# EAGLE design Flodar_Board_V1-3-1 (EAGLE 9.6.2)
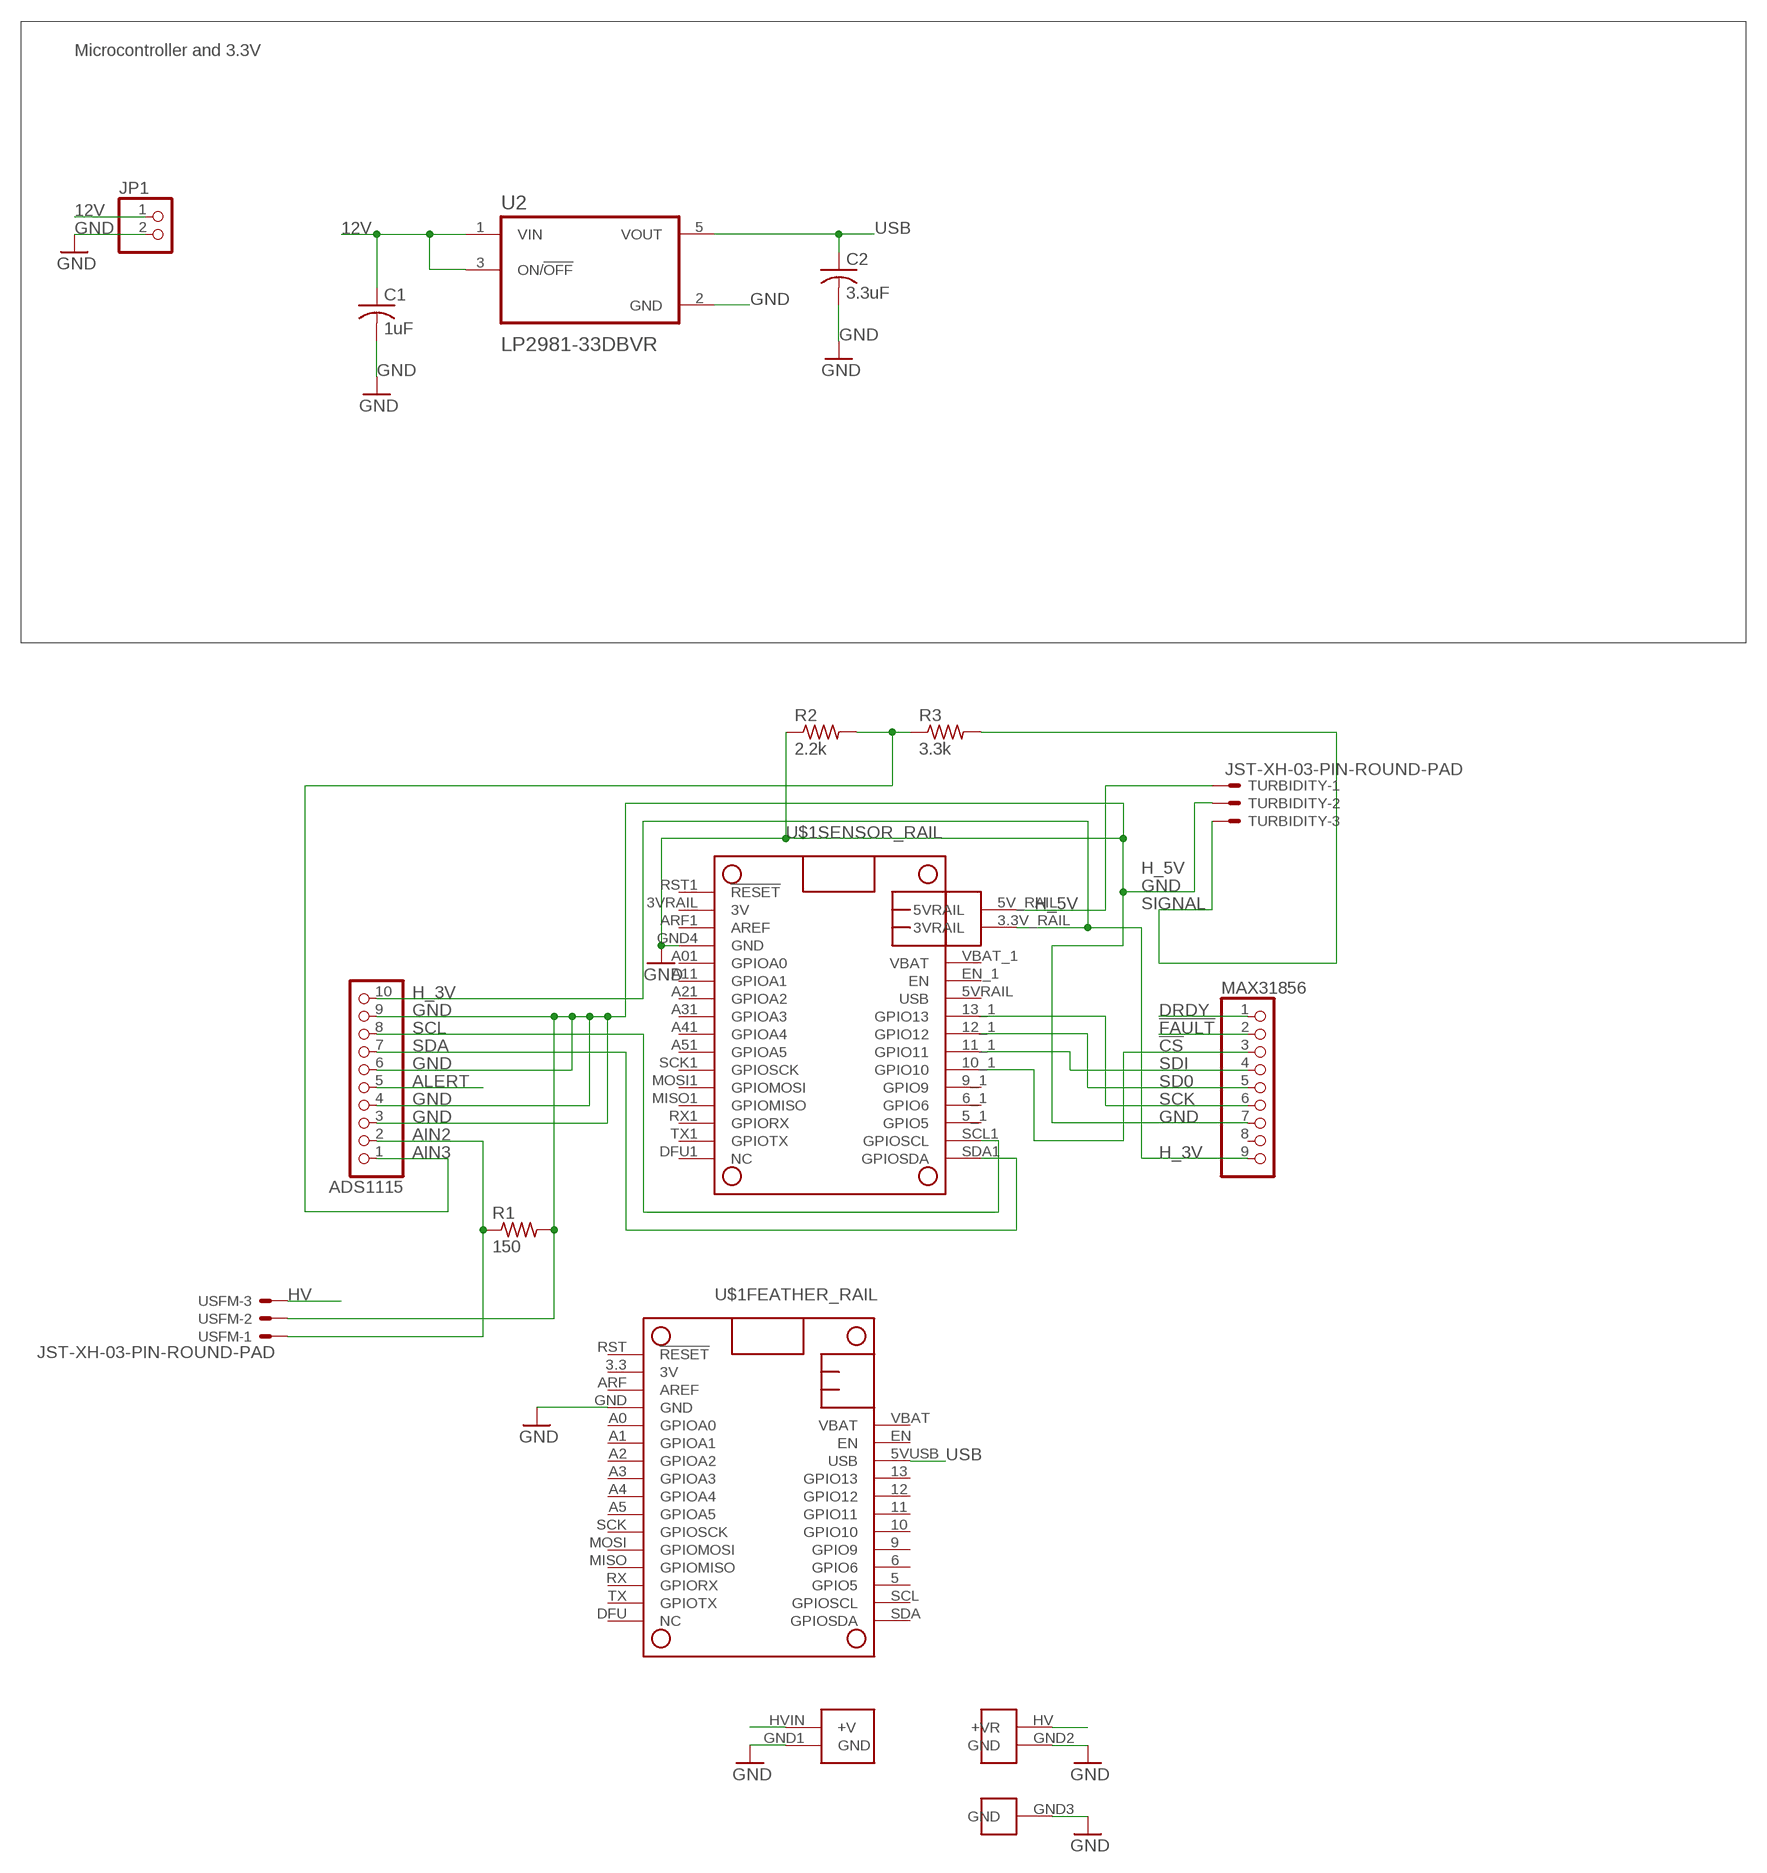
[diagram p0: schematic, sheet 1]

## Parts
ADS1115  HEADER-1X1070MIL  [1X10_ROUND70]
C1  1uF  C-USC1206  [C1206]
C2  3.3uF  C-USC1206  [C1206]
JP1  PINHD-1X2  [1X02]
MAX31856  HEADER-1X970MIL  [1X09_ROUND_70]
R1  150  R-US_R1206  [R1206]
R2  2.2k  R-US_R1206  [R1206]
R3  3.3k  R-US_R1206  [R1206]
TURBIDITY  JST-XH-03-PIN-ROUND-PAD  [JST-XH-03-PACKAGE-ROUND-PAD]
U2  LP2981-33DBVR  LP2981-50DBVR  [SOT95P280X145-5N]
U$1  HYPNOS_V3  [HYPNOS_V3]
USFM  JST-XH-03-PIN-ROUND-PAD  [JST-XH-03-PACKAGE-ROUND-PAD]

## Nets
12V: C1.1 JP1.1 U2.1(VIN) U2.3(ON/!OFF) U$1.HVIN(+V)
!CS: MAX31856.3 U$1.10_1(SENSOR_RAIL:GPIO10)
!FAULT: MAX31856.2
AIN2: ADS1115.2 R1.1 USFM.1
AIN3: ADS1115.1 R2.2 R3.1
ALERT: ADS1115.5
DRDY: MAX31856.1
GND: ADS1115.3 ADS1115.4 ADS1115.6 ADS1115.9 C1.2 C2.2 JP1.2 MAX31856.7 R1.2 R2.1 TURBIDITY.2 U2.2(GND) U$1.GND1(GND) U$1.GND2(GND) U$1.GND3(GND) U$1.GND4(SENSOR_RAIL:GND) U$1.GND(FEATHER_RAIL:GND) USFM.2
H_3V: ADS1115.10 MAX31856.9 U$1.3.3V_RAIL(3VRAIL)
H_5V: TURBIDITY.1 U$1.5V_RAIL(5VRAIL)
HV: U$1.HV(+VR) USFM.3
SCK: MAX31856.6 U$1.13_1(SENSOR_RAIL:GPIO13)
SCL: ADS1115.8 U$1.SCL1(SENSOR_RAIL:GPIOSCL)
SD0: MAX31856.5 U$1.12_1(SENSOR_RAIL:GPIO12)
SDA: ADS1115.7 U$1.SDA1(SENSOR_RAIL:GPIOSDA)
SDI: MAX31856.4 U$1.11_1(SENSOR_RAIL:GPIO11)
SIGNAL: R3.2 TURBIDITY.3
USB: C2.1 U2.5(VOUT) U$1.5VUSB(FEATHER_RAIL:USB)
Unconnected: MAX31856.8 U$1.3.3(FEATHER_RAIL:3V) U$1.3VRAIL(SENSOR_RAIL:3V) U$1.5(FEATHER_RAIL:GPIO5) U$1.5_1(SENSOR_RAIL:GPIO5) U$1.5VRAIL(SENSOR_RAIL:USB) U$1.6(FEATHER_RAIL:GPIO6) U$1.6_1(SENSOR_RAIL:GPIO6) U$1.9(FEATHER_RAIL:GPIO9) U$1.9_1(SENSOR_RAIL:GPIO9) U$1.10(FEATHER_RAIL:GPIO10) U$1.11(FEATHER_RAIL:GPIO11) U$1.12(FEATHER_RAIL:GPIO12) U$1.13(FEATHER_RAIL:GPIO13) U$1.A0(FEATHER_RAIL:GPIOA0) U$1.A1(FEATHER_RAIL:GPIOA1) U$1.A01(SENSOR_RAIL:GPIOA0) U$1.A2(FEATHER_RAIL:GPIOA2) U$1.A3(FEATHER_RAIL:GPIOA3) U$1.A4(FEATHER_RAIL:GPIOA4) U$1.A5(FEATHER_RAIL:GPIOA5) U$1.A11(SENSOR_RAIL:GPIOA1) U$1.A21(SENSOR_RAIL:GPIOA2) U$1.A31(SENSOR_RAIL:GPIOA3) U$1.A41(SENSOR_RAIL:GPIOA4) U$1.A51(SENSOR_RAIL:GPIOA5) U$1.ARF1(SENSOR_RAIL:AREF) U$1.ARF(FEATHER_RAIL:AREF) U$1.DFU1(SENSOR_RAIL:NC) U$1.DFU(FEATHER_RAIL:NC) U$1.EN(FEATHER_RAIL:EN) U$1.EN_1(SENSOR_RAIL:EN) U$1.MISO1(SENSOR_RAIL:GPIOMISO) U$1.MISO(FEATHER_RAIL:GPIOMISO) U$1.MOSI1(SENSOR_RAIL:GPIOMOSI) U$1.MOSI(FEATHER_RAIL:GPIOMOSI) U$1.RST1(SENSOR_RAIL:!RESET) U$1.RST(FEATHER_RAIL:!RESET) U$1.RX1(SENSOR_RAIL:GPIORX) U$1.RX(FEATHER_RAIL:GPIORX) U$1.SCK1(SENSOR_RAIL:GPIOSCK) U$1.SCK(FEATHER_RAIL:GPIOSCK) U$1.SCL(FEATHER_RAIL:GPIOSCL) U$1.SDA(FEATHER_RAIL:GPIOSDA) U$1.TX1(SENSOR_RAIL:GPIOTX) U$1.TX(FEATHER_RAIL:GPIOTX) U$1.VBAT(FEATHER_RAIL:VBAT) U$1.VBAT_1(SENSOR_RAIL:VBAT)

## Notes on the sheet
- Microcontroller and 3.3V

## Library data of the parts
ADS1115 = microbuilder:HEADER-1X10: PIN HEADER
C1 C2 = rcl:C-US: CAPACITOR, American symbol; SPICEPREFIX: C
JP1 = pinhead:PINHD-1X2: PIN HEADER
MAX31856 = microbuilder:HEADER-1X9: PIN HEADER
R1-R3 = adafruit:R-US_: RESISTOR, American symbol
TURBIDITY USFM = Rembrandt Electronics - JST XH Connectors v1-0:JST-XH-03-PIN: JST XH Connector 2 Pin Wire to board connector. Pitch: 2,54 mm, (0.100") Number of pins: 3 Created by Rembrandt Electronics www.rembrandtelectronics.com
U2 = LP2981-33DBVR:LP2981-50DBVR: Check prices <https://pricing.snapeda.com/parts/LP2981-50DBVR/Texas%20Instruments/view-part?ref=eda>; AVAILABILITY: In Stock; DESCRIPTION: 100-mA, 16-V, low-dropout voltage regulator with enable 5-SOT-23 -40 to 125; MF: Texas Instruments; MP: LP2981-50DBVR; PACKAGE: SOT-23-5 Texas Instruments; PRICE: None; PURCHASE-URL: https://pricing.snapeda.com/search/part/LP2981-50DBVR/?ref=eda
U$1 = HYPNOS_V3:HYPNOS_V3

## Board
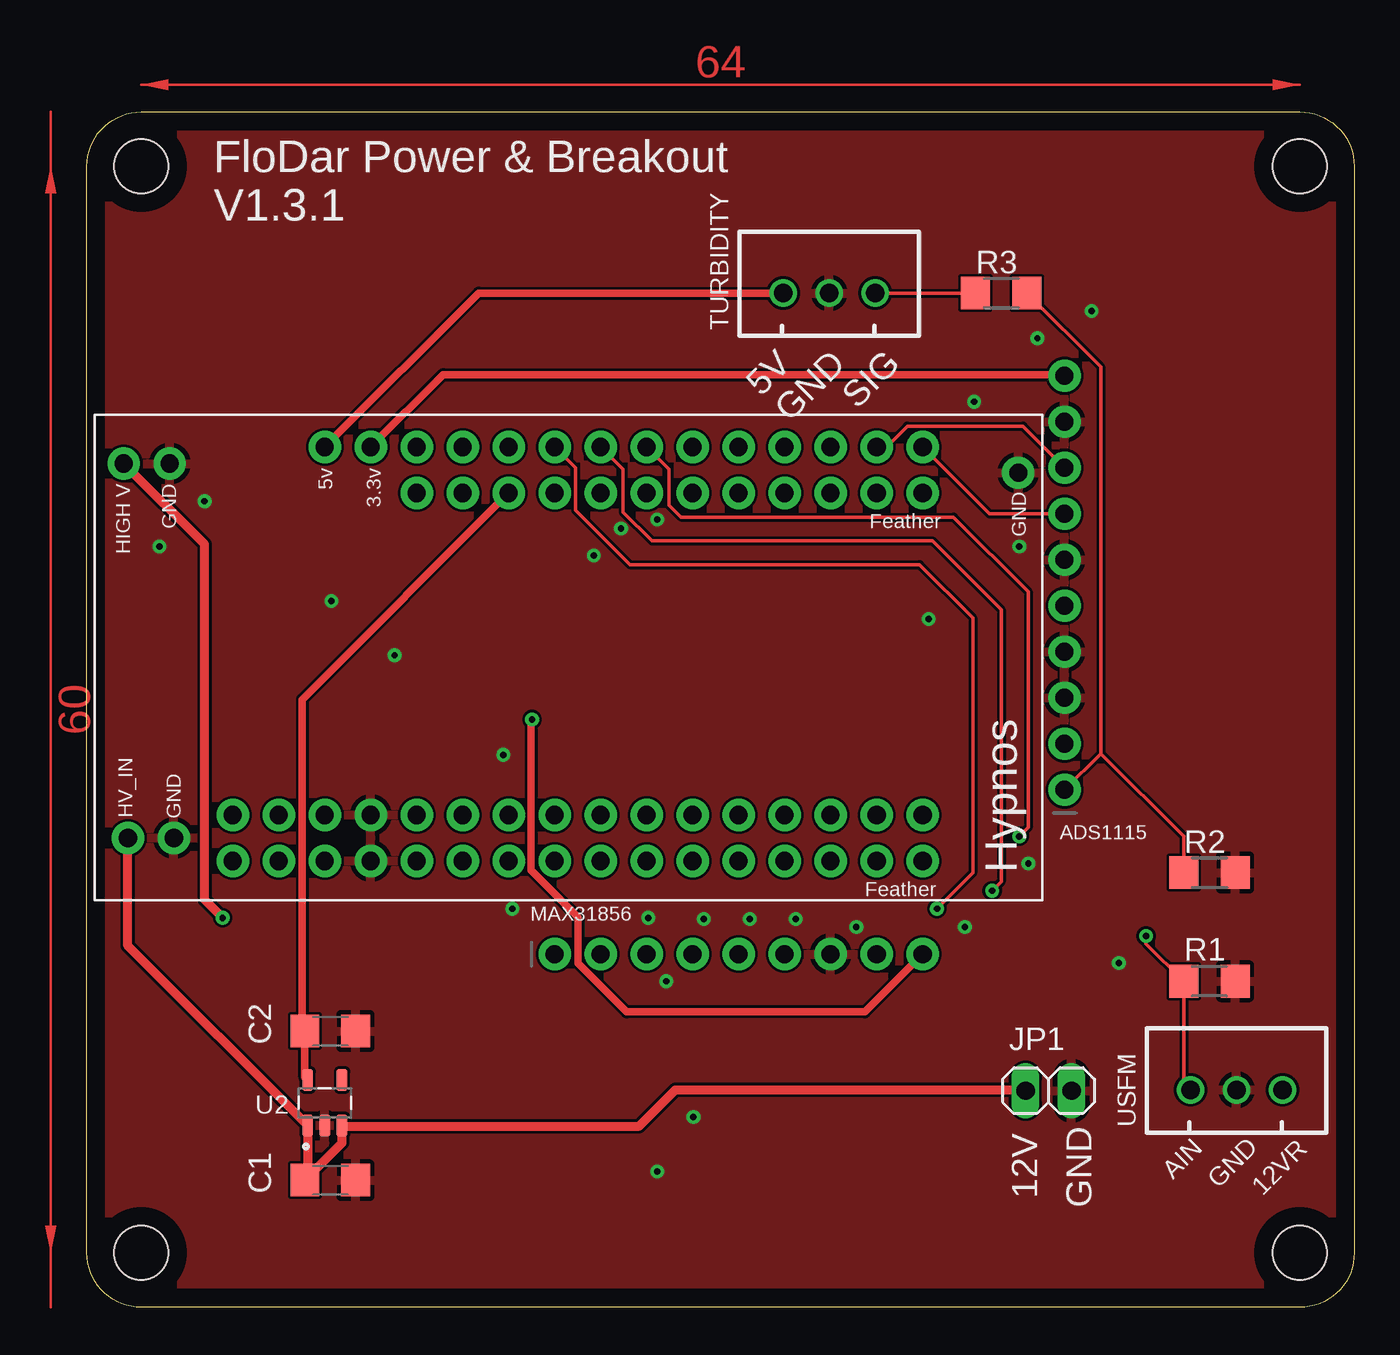
[diagram p1: board, top side]
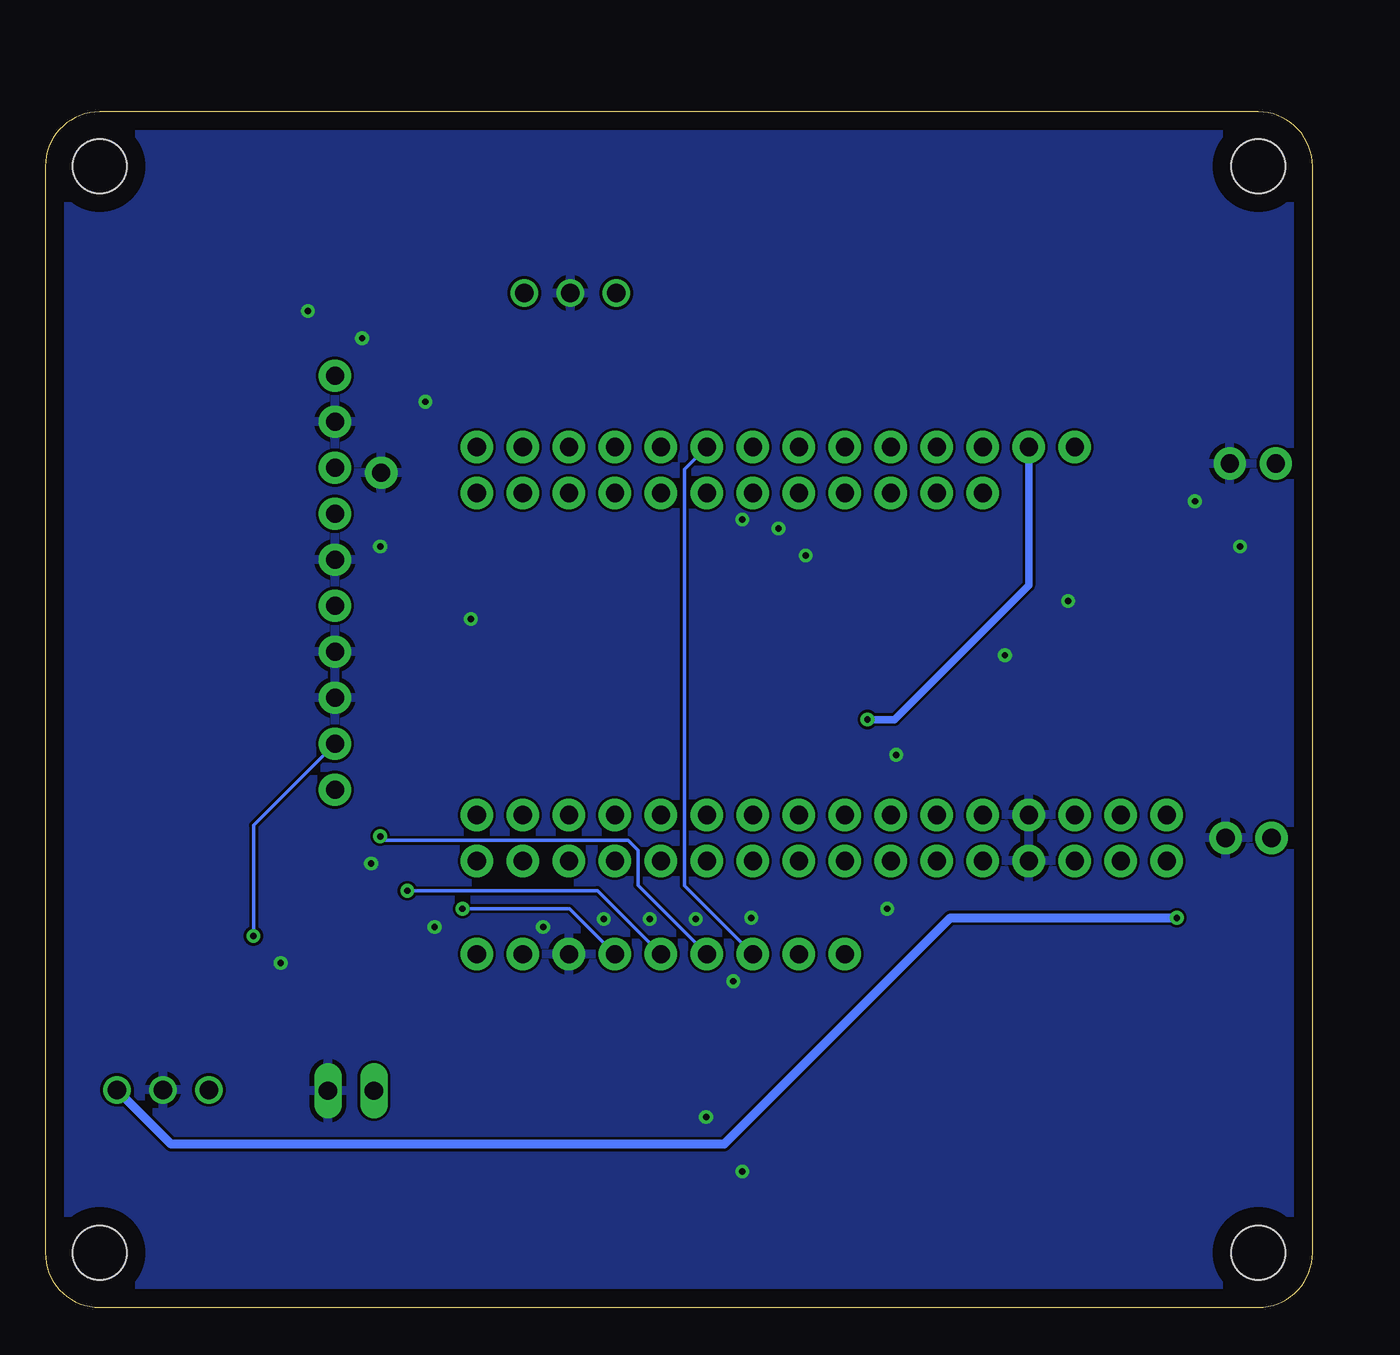
[diagram p2: board, bottom side, seen from below]

Size 70 x 66 mm. Coordinates in mm from the lower left corner, seen from the top.
Outline: 0,63 arc-90 3,66 67,66 arc-90 70,63 70,3 arc-90 67,0 3,0 arc-90 0,3 0,63
Copper layers (1*16): Top 0.035mm / dielectric 1.5mm / Bottom 0.035mm
Design rules "default": minimum track width 6mil, minimum drill 0.35mm, track to track 6mil, track to pad 6mil, pad to pad 6mil, via to via 6mil, smd to smd 6mil, copper to edge 40mil, drill to drill 6mil, minimum pad ring 10mil, minimum via ring 8mil, stop-mask expansion 4mil, vias tented up to drill 0mil, thermal gap 10mil
Holes 3 mm at 67,3 67,63 3,63 3,3

### Footprints (pad centres in the part's own frame; a part is rotated, then mirrored left to right if it is on the bottom)
1X10_ROUND70 = drill 1 pad 1.778: 1 -11.43,0; 2 -8.89,0; 3 -6.35,0; 4 -3.81,0; 5 -1.27,0; 6 1.27,0; 7 3.81,0; 8 6.35,0; 9 8.89,0; 10 11.43,0
C1206 = smd 1.6 x 1.8: 1 -1.4,0; 2 1.4,0
1X02 = drill 1.016 long: 1 -1.27,0; 2 1.27,0
1X09_ROUND_70 = drill 1 pad 1.778: 1 -10.16,0; 2 -7.62,0; 3 -5.08,0; 4 -2.54,0; 5 0,0; 6 2.54,0; 7 5.08,0; 8 7.62,0; 9 10.16,0
R1206 = smd 1.6 x 1.803: 1 -1.422,0; 2 1.422,0
JST-XH-03-PACKAGE-ROUND-PAD = drill 1.016: 1 -2.54,0; 2 0,0; 3 2.54,0
SOT95P280X145-5N = smd 1.21 x 0.59: 1 -1.255,0.95; 2 -1.255,0; 3 -1.255,-0.95; 4 1.255,-0.95; 5 1.255,0.95
HYPNOS_V3 = drill 1 pad 1.778: 3.3 -22.86,25.4; 3.3V_RAIL 0,20.32; 3VRAIL -20.32,25.4; 5 -2.54,-5.08; 5_1 0,-5.08; 5V_RAIL 0,22.86; 5VRAIL 0,12.7; 5VUSB -2.54,12.7; 6 -2.54,-2.54; 6_1 0,-2.54; 9 -2.54,0; 9_1 0,0; 10 -2.54,2.54; 10_1 0,2.54; 11 -2.54,5.08; 11_1 0,5.08; 12 -2.54,7.62; 12_1 0,7.62; 13 -2.54,10.16; 13_1 0,10.16; A0 -22.86,17.78; A01 -20.32,17.78; A1 -22.86,15.24; A2 -22.86,12.7; A3 -22.86,10.16; A4 -22.86,7.62; A5 -22.86,5.08; A11 -20.32,15.24; A21 -20.32,12.7; A31 -20.32,10.16; A41 -20.32,7.62; A51 -20.32,5.08; ARF -22.86,22.86; ARF1 -20.32,22.86; DFU -22.86,-10.16; DFU1 -20.32,-10.16; EN -2.54,15.24; EN_1 0,15.24; GND -22.86,20.32; GND1 -1.422,-15.44; GND2 -20.32,20.32; GND3 -21.59,31.194; GND4 -0.914,31.423; HV -0.914,33.963; HVIN -21.59,33.734; MISO -22.86,-2.54; MISO1 -20.32,-2.54; MOSI -22.86,0; MOSI1 -20.32,0; RST -22.86,27.94; RST1 -20.32,27.94; RX -22.86,-5.08; RX1 -20.32,-5.08; SCK -22.86,2.54; SCK1 -20.32,2.54; SCL -2.54,-7.62; SCL1 0,-7.62; SDA -2.54,-10.16; SDA1 0,-10.16; TX -22.86,-7.62; TX1 -20.32,-7.62; VBAT -2.54,17.78; VBAT_1 0,17.78

### Placement (x,y rotation side)
ADS1115  54,40 90 top
C1  13.44,7.02 0 top
C2  13.44,15.25 0 top
JP1  53.11,11.95 0 top
MAX31856  36,19.5 0 top
R1  62,18 0 top
R2  62,24 180 top
R3  50.5,56 180 top
TURBIDITY  41,56 0 top
U2  13.14,11.29 90 top
U$1  36,47.5 90 top
USFM  63.5,12 0 top

### Tracks (layer width: path | path; a pad name or v marks a point on that pad's centre or on a via)
12V
  Top 0.508: U$1.HVIN 2.27,19.96 U2.1 12.19,7.17 C1.1 14.09,9.07 U2.3 14.12,10 30.5,10 32.5,12 51.8,12 JP1.1
!CS
  Bottom 0.203: MAX31856.3 34.7,23.28 34.7,46.26 U$1.10_1
AIN2  (via drill 0.35)
  Top 0.203: v58.5,20.5 58.5,20.08 R1.1 60.58,12.38 USFM.1
  Bottom 0.203: ADS1115.2 58.5,26.61 v58.5,20.5
AIN3
  Top 0.203: R3.1 56,51.92 56,30.57 | ADS1115.1 56,30.57 | 56,30.57 60.58,25.99 R2.2
GND  (via drill 0.35)
  other vias: 28,41.5 29.5,43 31.5,43.5 51.5,42 46.5,38 48.5,21 42.5,21 31,21.5 39.15,21.43 36.61,21.43 34.07,21.43 4,42 6.5,44.5 52.5,53.5 55.5,55 49,50 52,24.5 57,19 23,30.5 31.5,7.5 33.5,10.5 17,36 13.5,39 23.5,22 32,18
  pour Top: -0.5,66 -0.5,-0.5 71,-0.5 71,66.5 -0.5,66.5
  pour Bottom: -0.5,66.5 -0.5,-0.5 71,-0.5 71,66.5
H_3V  (via drill 0.35)
  Top 0.406: U$1.3.3V_RAIL 19.68,51.5 53.93,51.5 ADS1115.10 | v24.58,32.45 24.55,32.41 24.55,24.12 27.14,21.53 27.14,18.98 29.81,16.31 42.97,16.31 MAX31856.9
  Bottom 0.406: U$1.3.3V_RAIL 15.68,39.85 23.08,32.45 v24.58,32.45
H_5V
  Top 0.406: U$1.5V_RAIL 21.64,56 TURBIDITY.1
HV  (via drill 0.35)
  Top 0.508: U$1.HV 6.5,42.12 6.5,22.5 v7.5,21.5
  Bottom 0.508: USFM.3 63.04,9 32.5,9 21,20.5 20,21.5 v7.5,21.5
SCK  (via drill 0.35)
  Top 0.203: U$1.13_1 27,46.34 27,44 29.99,41.01 45.99,41.01 48.94,38.06 48.94,23.98 v46.95,22
  Bottom 0.203: MAX31856.6 41.04,22 v46.95,22
SCL
  Top 0.203: U$1.SCL1 44.18,47.5 45.32,48.64 51.71,48.64 ADS1115.8
SD0  (via drill 0.35)
  Top 0.203: U$1.12_1 29.62,46.26 29.62,43.9 31.21,42.31 46.69,42.31 50.5,38.5 50.5,23.5 v50,23
  Bottom 0.203: v50,23 39.5,23 MAX31856.5
SDA
  Top 0.203: U$1.SDA1 49.85,43.81 ADS1115.7
SDI  (via drill 0.35)
  Top 0.203: U$1.11_1 32.16,46.26 32.16,44.28 32.82,43.63 47.87,43.63 52,39.5 52,26.5 v51.5,26
  Bottom 0.203: v51.5,26 51.28,25.78 37.82,25.78 37.27,25.23 37.27,23.31 MAX31856.4
SIGNAL
  Top 0.203: TURBIDITY.3 R3.2
USB
  Top 0.406: U$1.5VUSB 11.89,33.55 11.89,15.39 C2.1 12.04,12.7 U2.5
(copper drawn outside any net)
  shapes: Top area x4

### Text on the board
tPlace: 5V | GND | SIG | AIN | 12V | GND | GND | 12VR
tNames: FloDar Power & Breakout / V1.3.1